# Altium schematic sheet Beta0.1.5 Schematic diagram.schdoc
size 267 x 95 mm
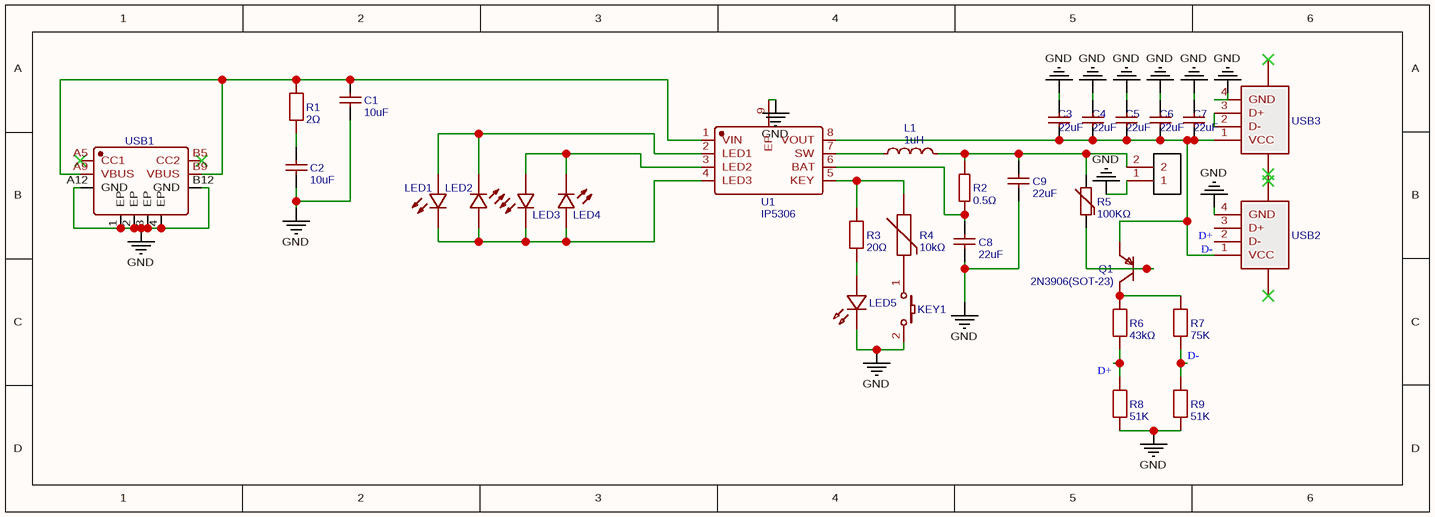
[diagram p0: Beta0.1.5 Schematic diagram.schdoc]

## Parts
C1  10uF  [C1206]
C2  10uF  [C1206]
C3  22uF  [C1206]
C4  22uF  [C1206]
C5  22uF  [C1206]
C6  22uF  [C1206]
C7  22uF  [C1206]
C8  22uF  [C1206]
C9  22uF  [C1206]
CN1  254010-02A-T0P  [CONN-TH_2P-P2.54_HX25411-2A]  (value not drawn)
KEY1  K2-3.6×6.1_SMD  [KEY-SMD_2P-L6.2-W3.6-LS8.0]  (value not drawn)
L1  1uH  [IND-SMD_L7.1-W6.5-P5.60]
LED1  LED1  [LED-0603]  (value not drawn)
LED2  LED1  [LED-0603]  (value not drawn)
LED3  LED1  [LED-0603]  (value not drawn)
LED4  LED1  [LED-0603]  (value not drawn)
LED5  TZ-P2-1206WYCS2-0.9T  [LED1206-RD_WHITE]  (value not drawn)
Q1  2N3906(SOT-23)  [SOT-23-3_L2.9-W1.6-P1.90-LS2.8-TR-CW]
R1  2Ω  [R0603]
R2  0.5Ω  [R2010]
R3  20Ω  [R0603]
R4  10kΩ  [R0402]
R5  100KΩ  [R0603]
R6  43kΩ  [R1812]
R7  75K  [R1210]
R8  51K  [R0402]
R9  51K  [R0402]
U1  IP5306  [ESOP-8_L4.9-W3.9-P1.27-LS6.0-BL-EP]
USB1  KH-TYPE-C-6P-T  [TYPE-C-SMD_TYPE-C-31-M-16]  (value not drawn)
USB2  292303-1  [USB-A-TH_USB-302-T]  (value not drawn)
USB3  292303-1  [USB-A-TH_USB-302-T]  (value not drawn)

## Nets
GND: C1.2 C2.2 C3.2 C4.2 C5.2 C6.2 C7.2 C8.1 C9.1 CN1.1 KEY1.2 LED5.1(K) R8.1 R9.1 U1.9(EP) USB1.1(EP) USB1.2(EP) USB1.3(EP) USB1.4(EP) USB1.A12(GND) USB1.B12(GND) USB2.4(GND) USB3.4(GND)
D+: R6.1 R8.2 USB2.3(D+)
D-: R7.1 R9.2 USB2.2(D-)
NetC1_1: C1.1 R1.1 U1.1(VIN) USB1.A9(VBUS) USB1.B9(VBUS)
NetC2_1: C2.1 R1.2
NetC3_1: C3.1 C4.1 C5.1 C6.1 C7.1 Q1.1(E) U1.8(VOUT) USB2.1(VCC) USB3.1(VCC)
NetC8_2: C8.2 R2.1 U1.6(BAT)
NetC9_2: C9.2 CN1.2 L1.2 R2.2 R5.2
NetKEY1_1: KEY1.1 R4.1
NetL1_1: L1.1 U1.7(SW)
NetLED1_1: LED1.1(A) LED2.2(K) U1.2(LED1)
NetLED1_2: LED1.2(K) LED2.1(A) LED3.2(K) LED4.1(A) U1.4(LED3)
NetLED3_1: LED3.1(A) LED4.2(K) U1.3(LED2)
NetLED5_2: LED5.2(A) R3.1
NetQ1_2: Q1.2(B) R5.1
NetQ1_3: Q1.3(C) R6.2 R7.2
NetR3_2: R3.2 R4.2 U1.5(KEY)
NetUSB3_2: USB3.2(D-) USB3.3(D+)

Not connected (* = marked no-connect by the designer): USB1 A5(CC1)* B5(CC2)*; USB2 5* 6*; USB3 5* 6*

## Library data of the parts
C1 C2 = 10uF: BOM_Manufacturer Part: CL31A106KBHNNNE; BOM_Manufacturer: SAMSUNG; nameAlias: Capacitance; BOM_Supplier: LCSC; BOM_Supplier Part: C13585; BOM_JLCPCB Part Class: Basic Part; spicePre: C; spiceSymbolName: CL31A106KBHNNNE
C3-C9 = 22uF: BOM_Manufacturer Part: CL31A226KPHNNNE; BOM_Manufacturer: SAMSUNG; nameAlias: Capacitance; BOM_Supplier: LCSC; BOM_Supplier Part: C5672; BOM_JLCPCB Part Class: Basic Part; spicePre: C; spiceSymbolName: CL31A226KPHNNNE
CN1 = 254010-02A-T0P: BOM_Manufacturer: Zhejiang Yueqing Hongxing Elec; Contributor: LCSC; BOM_Supplier: LCSC; BOM_Supplier Part: C181912; BOM_Manufacturer Part: 254010-02A-T0P; BOM_JLCPCB Part Class: Extended Part; spicePre: C; spiceSymbolName: 254010-02A-T0P
KEY1 = K2-3.6×6.1_SMD: BOM_Manufacturer Part: K2-1107ST-A4SW-06; Contributor: LCEDA_Lib; 制造商: 韩国韩荣; BOM_Supplier Part: C118141; BOM_Supplier: LCSC; spicePre: K; spiceSymbolName: K2-3.6×6.1_SMD
L1 = 1uH: BOM_Manufacturer: TDK; BOM_Manufacturer Part: SPM6530T-1R0M120; nameAlias: Inductance; BOM_Supplier: LCSC; BOM_Supplier Part: C87572; BOM_JLCPCB Part Class: Extended Part; spicePre: L; spiceSymbolName: SPM6530T-1R0M120
LED1-LED4 = LED1: BOM_Manufacturer: NATIONSTAR; BOM_Manufacturer Part: FC-DA1608HRK-620D; BOM_Supplier: LCSC; BOM_Supplier Part: C84263; spicePre: L
LED5 = TZ-P2-1206WYCS2-0.9T: BOM_Manufacturer: TUOZHAN; Contributor: LCSC; BOM_Supplier: LCSC; BOM_Supplier Part: C779809; BOM_Manufacturer Part: TZ-P2-1206WYCS2-0.9T; BOM_JLCPCB Part Class: Extended Part; spicePre: L; spiceSymbolName: TZ-P2-1206WYCS2-0.9T
Q1 = 2N3906(SOT-23): BOM_Manufacturer: KEC; BOM_Manufacturer Part: 2N3906S-RTK/PS; Contributor: LCEDA_Lib; BOM_Supplier: LCSC; BOM_Supplier Part: C147294; spicePre: Q; spiceSymbolName: 2N3906(SOT-23)
R1 = 2Ω: BOM_Manufacturer: YAGEO; BOM_Manufacturer Part: RT0603BRD072RL; nameAlias: Resistance (Ohms); Contributor: LCSC; BOM_Supplier: LCSC; BOM_Supplier Part: C723696; Resistance: 2Ω; BOM_JLCPCB Part Class: Extended Part; spicePre: R; spiceSymbolName: RT0603BRD072RL
R2 = 0.5Ω: BOM_Manufacturer: Uniroyal Elec; BOM_Manufacturer Part: 201007F500LT4E; Resistance (Ohms): 0.5; nameAlias: Resistance; Contributor: LCSC; BOM_Supplier: LCSC; BOM_Supplier Part: C270967; BOM_JLCPCB Part Class: Extended Part; spicePre: R; spiceSymbolName: 201007F500LT4E
R3 = 20Ω: BOM_Manufacturer: VISHAY(威世); BOM_Manufacturer Part: CRCW060320R0FKEAHP; nameAlias: Resistance; Contributor: lcsc; BOM_Supplier: LCSC; BOM_Supplier Part: C313703; spicePre: R; spiceSymbolName: CRCW060320R0FKEAHP
R4 = 10kΩ: BOM_Manufacturer: TDK; BOM_Manufacturer Part: B57221V2103J060; nameAlias: Value; BOM_Supplier: LCSC; BOM_Supplier Part: C117695; BOM_JLCPCB Part Class: Extended Part; spicePre: R; spiceSymbolName: B57221V2103J060
R5 = 100KΩ: BOM_Manufacturer: Sunlord; BOM_Manufacturer Part: SDNT1608X104J4250HTF; nameAlias: Value; BOM_Supplier: LCSC; BOM_Supplier Part: C92368; BOM_JLCPCB Part Class: Extended Part; spicePre: R; spiceSymbolName: SDNT1608X104J4250HTF
R6 = 43kΩ: BOM_Manufacturer: Uniroyal Elec; BOM_Manufacturer Part: 181207J0433T4E; Resistance (Ohms): 43K; nameAlias: Resistance; Contributor: LCSC; BOM_Supplier: LCSC; BOM_Supplier Part: C421987; BOM_JLCPCB Part Class: Extended Part; spicePre: R; spiceSymbolName: 181207J0433T4E
R7 = 75K: BOM_Manufacturer: YAGEO; BOM_Manufacturer Part: AC1210JR-0775KL; nameAlias: Resistance (Ohms); Contributor: LCSC; Resistance: 75kΩ; BOM_Supplier: LCSC; BOM_Supplier Part: C230492; BOM_JLCPCB Part Class: Extended Part; spicePre: R; spiceSymbolName: AC1210JR-0775KL
R8 R9 = 51K: BOM_Manufacturer: YAGEO; BOM_Manufacturer Part: AC0402DR-0751KL; nameAlias: Resistance (Ohms); Contributor: LCSC; Resistance: 51kΩ; BOM_Supplier: LCSC; BOM_Supplier Part: C226721; BOM_JLCPCB Part Class: Extended Part; spicePre: R; spiceSymbolName: AC0402DR-0751KL
U1 = IP5306: BOM_Manufacturer: INJOINIC; Contributor: LCSC; BOM_Supplier: LCSC; BOM_Supplier Part: C181692; BOM_Manufacturer Part: IP5306; BOM_JLCPCB Part Class: Extended Part; spicePre: U; spiceSymbolName: IP5306
USB1 = KH-TYPE-C-6P-T: BOM_Manufacturer: Shenzhen Kinghelm Elec; Contributor: LCSC; BOM_Supplier: LCSC; BOM_Supplier Part: C709356; BOM_Manufacturer Part: KH-TYPE-C-6P-T; BOM_JLCPCB Part Class: Extended Part; spicePre: U; spiceSymbolName: KH-TYPE-C-6P-T
USB2 USB3 = 292303-1: BOM_Manufacturer: TE Connectivity; BOM_Supplier: LCSC; BOM_Manufacturer Part: 292303-1; BOM_Supplier Part: C86461; BOM_JLCPCB Part Class: Extended Part; spicePre: U; spiceSymbolName: 292303-1